# EAGLE schematic psg-8ch (EAGLE 6.6.0)
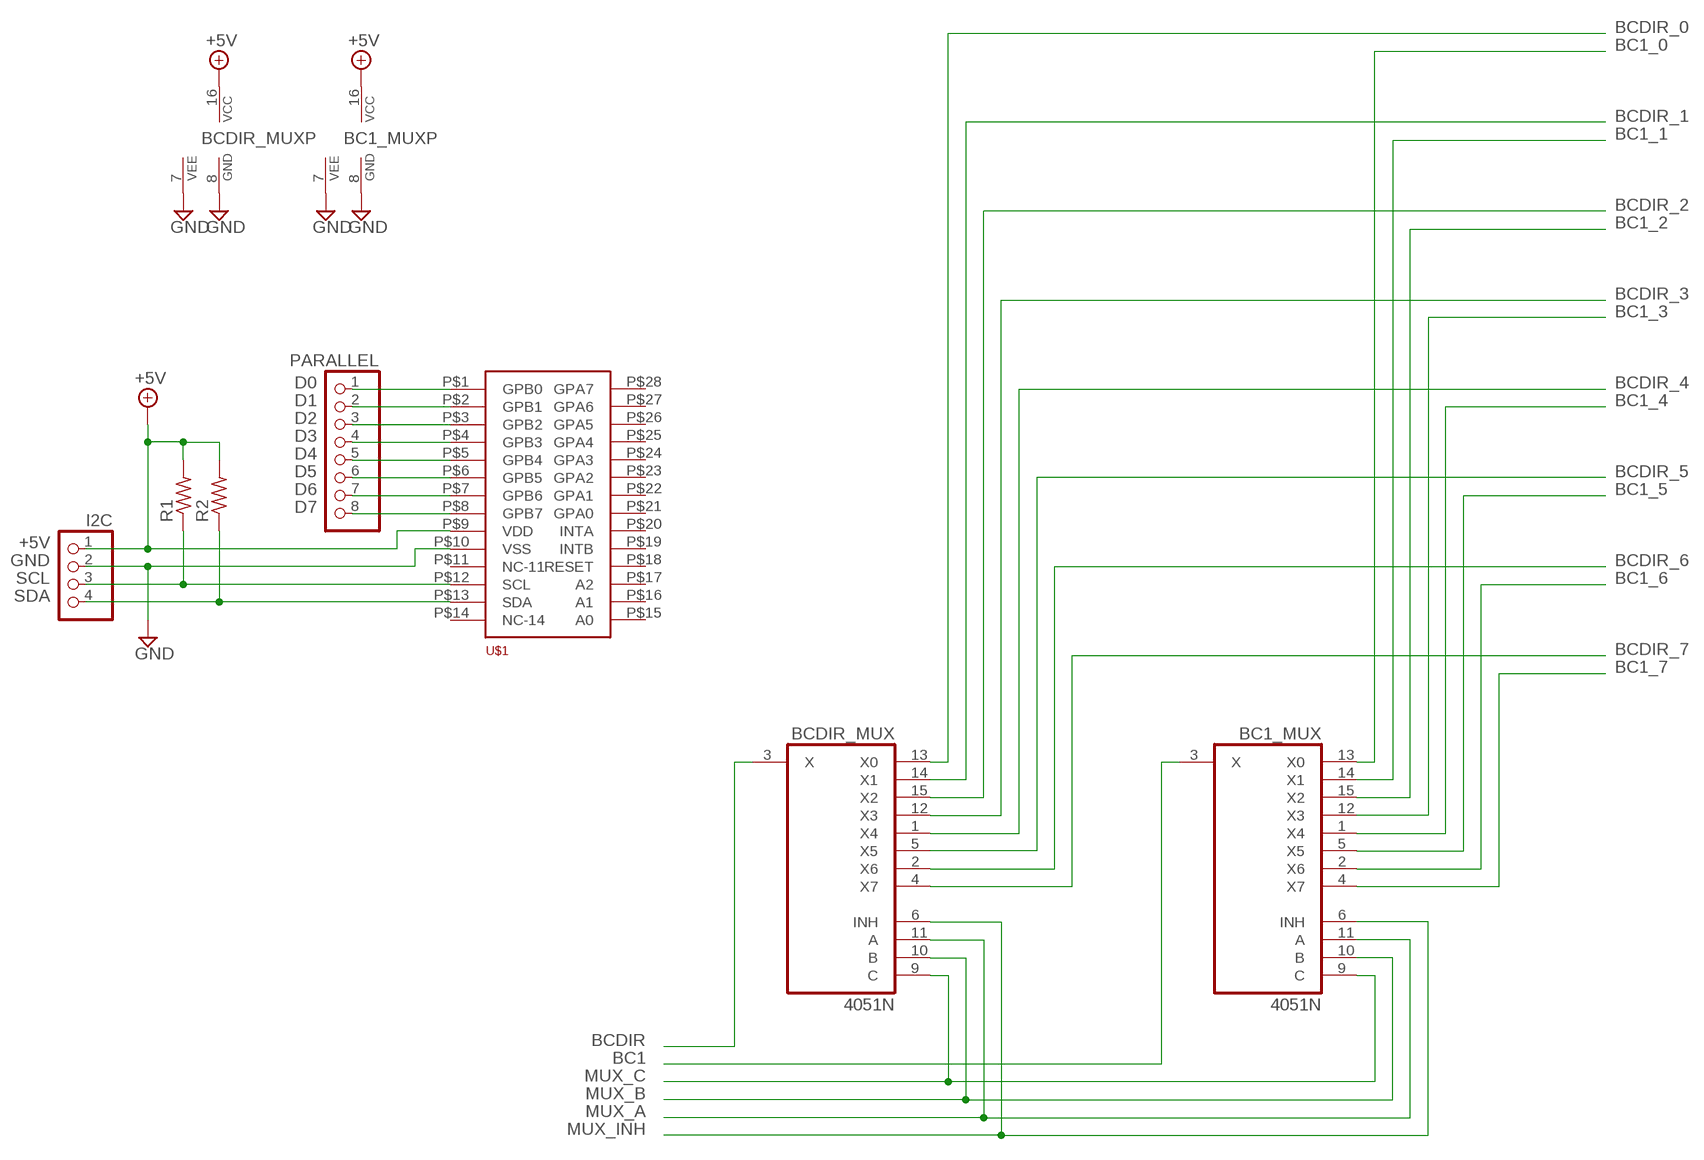
[diagram p0: schematic, sheet 1]

## Parts
BC1_MUX  4051N  [DIL16]
BCDIR_MUX  4051N  [DIL16]
I2C  PINHD-1X4  [1X04]
PARALLEL  PINHD-1X8  [1X08]
R1  6MM.3  [R0207/3]
R2  6MM.3  [R0207/3]
U$1  MCP23017-E/SP  [DIP28]

## Nets
+5V: BC1_MUX.16(VCC) BCDIR_MUX.16(VCC) I2C.1 R1.2 R2.2 U$1.P$9(VDD)
BC1: BC1_MUX.3(X)
BC1_0: BC1_MUX.13(X0)
BC1_1: BC1_MUX.14(X1)
BC1_2: BC1_MUX.15(X2)
BC1_3: BC1_MUX.12(X3)
BC1_4: BC1_MUX.1(X4)
BC1_5: BC1_MUX.5(X5)
BC1_6: BC1_MUX.2(X6)
BC1_7: BC1_MUX.4(X7)
BCDIR: BCDIR_MUX.3(X)
BCDIR_0: BCDIR_MUX.13(X0)
BCDIR_1: BCDIR_MUX.14(X1)
BCDIR_2: BCDIR_MUX.15(X2)
BCDIR_3: BCDIR_MUX.12(X3)
BCDIR_4: BCDIR_MUX.1(X4)
BCDIR_5: BCDIR_MUX.5(X5)
BCDIR_6: BCDIR_MUX.2(X6)
BCDIR_7: BCDIR_MUX.4(X7)
D0: PARALLEL.1 U$1.P$1(GPB0)
D1: PARALLEL.2 U$1.P$2(GPB1)
D2: PARALLEL.3 U$1.P$3(GPB2)
D3: PARALLEL.4 U$1.P$4(GPB3)
D4: PARALLEL.5 U$1.P$5(GPB4)
D5: PARALLEL.6 U$1.P$6(GPB5)
D6: PARALLEL.7 U$1.P$7(GPB6)
D7: PARALLEL.8 U$1.P$8(GPB7)
GND: BC1_MUX.7(VEE) BC1_MUX.8(GND) BCDIR_MUX.7(VEE) BCDIR_MUX.8(GND) I2C.2 U$1.P$10(VSS)
MUX_A: BC1_MUX.11(A) BCDIR_MUX.11(A)
MUX_B: BC1_MUX.10(B) BCDIR_MUX.10(B)
MUX_C: BC1_MUX.9(C) BCDIR_MUX.9(C)
MUX_INH: BC1_MUX.6(INH) BCDIR_MUX.6(INH)
SCL: I2C.3 R1.1 U$1.P$12(SCL)
SDA: I2C.4 R2.1 U$1.P$13(SDA)
Unconnected: U$1.P$11(NC-11) U$1.P$14(NC-14) U$1.P$15(A0) U$1.P$16(A1) U$1.P$17(A2) U$1.P$18(RESET) U$1.P$19(INTB) U$1.P$20(INTA) U$1.P$21(GPA0) U$1.P$22(GPA1) U$1.P$23(GPA2) U$1.P$24(GPA3) U$1.P$25(GPA4) U$1.P$26(GPA5) U$1.P$27(GPA6) U$1.P$28(GPA7)

## Library data of the parts
BC1_MUX BCDIR_MUX = 40xx:4051: 8-channel ANALOG MULTIPLEXER
I2C = pinhead:PINHD-1X4: PIN HEADER
PARALLEL = pinhead:PINHD-1X8: PIN HEADER
R1 R2 = gm-resistors:6MM: 6mm Resistors Leads spaced 1-6 holes apart for 0.1" perfboard. Suitable for 1/4 watt resistors.
U$1 = IO-Expanders:MCP23017-E/SP: MCP23017 16 pin IO Expander using I2C bus; MCP23017-ESP: DIP